# Altium project OpenCameraSlider.PrjPcb
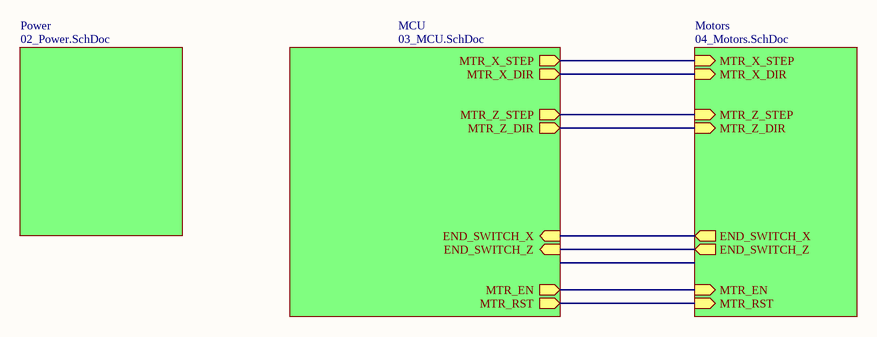
[diagram p0: 01_Top.SchDoc]
4 sheets, 18 parts. Net scope: hierarchical (ports join the sheet entries above them; power ports are global).
Board file: OpenCameraSlider_PCB.PcbDoc
Sheets:
  01_Top.SchDoc
    Power = 02_Power.SchDoc
    MCU = 03_MCU.SchDoc
    Motors = 04_Motors.SchDoc

## Sheet 01_Top.SchDoc: OpenCamera Slider - Top level schematic
size A4; SheetNumber: 1; SheetTotal: 4; Distributor: DigiKey

### Sub-sheets
MCU = 03_MCU.SchDoc: MTR_X_STEP (out), MTR_X_DIR (out), MTR_Z_STEP (out), MTR_Z_DIR (out), END_SWITCH_X (in), END_SWITCH_Z (in), MTR_EN (out), MTR_RST (out)
Motors = 04_Motors.SchDoc: MTR_X_STEP (in), MTR_Z_STEP (in), MTR_X_DIR (in), MTR_Z_DIR (in), END_SWITCH_Z (out), END_SWITCH_X (out), MTR_RST (in), MTR_EN (in)
Power = 02_Power.SchDoc: no entries

### Nets
END_SWITCH_X: sheet MCU/END_SWITCH_X, sheet Motors/END_SWITCH_X
END_SWITCH_Z: sheet MCU/END_SWITCH_Z, sheet Motors/END_SWITCH_Z
MTR_EN: sheet MCU/MTR_EN, sheet Motors/MTR_EN
MTR_RST: sheet MCU/MTR_RST, sheet Motors/MTR_RST
MTR_X_DIR: sheet MCU/MTR_X_DIR, sheet Motors/MTR_X_DIR
MTR_X_STEP: sheet MCU/MTR_X_STEP, sheet Motors/MTR_X_STEP
MTR_Z_DIR: sheet MCU/MTR_Z_DIR, sheet Motors/MTR_Z_DIR
MTR_Z_STEP: sheet MCU/MTR_Z_STEP, sheet Motors/MTR_Z_STEP

### Notes on the sheet
- sasakaranovic.com/youtube
- sasakaranovic.com
- sasakaranovic.com/github
- sasakaranovic.com/facebook
- sasakaranovic.com/twitter
- sasakaranovic.com/linkedin

## Sheet 02_Power.SchDoc: OpenCamera Slider - Power
size A4; SheetNumber: 2; SheetTotal: 4; Distributor: DigiKey
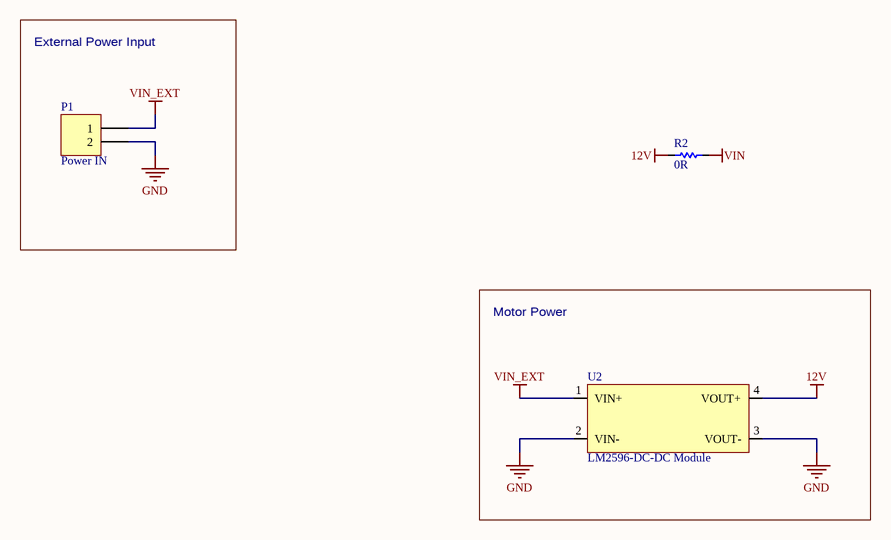
[diagram p1: 02_Power.SchDoc]

### Parts
P1  Power IN  [TERMINAL_2POS_90DEG_2PART]
R2  value 0R  [0603]  (hidden comment: Res)
U2  LM2596-DC-DC Module  [LM2596-DC-DC Module]

### Blocks framed on the sheet
External Power Input: P1
Motor Power: U2

### Nets
12V: R2.2 U2.4(VOUT+)
GND: P1.2 U2.2(VIN-) U2.3(VOUT-)
VIN: R2.1
VIN_EXT: P1.1 U2.1(VIN+)

### Notes on the sheet
- sasakaranovic.com/youtube
- sasakaranovic.com
- sasakaranovic.com/github
- sasakaranovic.com/facebook
- sasakaranovic.com/twitter
- sasakaranovic.com/linkedin

### Library data of the parts
P1 = Terminal 2_691322110002: 2 Position Terminal Block Header, Male Pins, Shrouded (4 Side) 0.138" (3.50mm) 90°, Right Angle - Through Hole; Manufacturer: Würth Elektronik; Manufacturer Part Number: 691322110002; Distributor: DigiKey; Distributor Part Number: 732-2769-ND
R2 = Res: Resistor; Manufacturer: YAGEO; Manufacturer Part Number: RC0603FR-130RL; Distributor: DigiKey; Distributor Part Number: 13-RC0603FR-130RLCT-ND
U2 = LM2596-DC-DC Module: LM2596-DC-DC Module HW-411; Distributor: AliExpress; Distributor Part Number: https://www.aliexpress.com/item/33004374185.html; Manufacturer Part Number: LM2596-DC-DC; URL: https://www.aliexpress.com/item/33004374185.html

## Sheet 03_MCU.SchDoc: OpenCamera Slider - MCU
size A4; SheetNumber: 3; SheetTotal: 4; Distributor: DigiKey
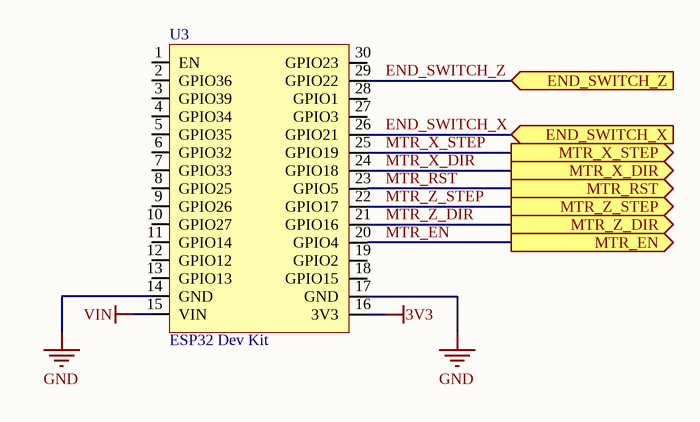
[diagram p2: 03_MCU.SchDoc]

### Parts
U3  ESP32 Dev Kit  [ESP32-DevModule]

### Ports
END_SWITCH_X (in), END_SWITCH_Z (in), MTR_EN (out), MTR_RST (out), MTR_X_DIR (out), MTR_X_STEP (out), MTR_Z_DIR (out), MTR_Z_STEP (out)

### Nets
3V3: U3.16(3V3)
GND: U3.14(GND) U3.17(GND)
VIN: U3.15(VIN)
END_SWITCH_X: U3.26(GPIO21) ; port END_SWITCH_X
END_SWITCH_Z: U3.29(GPIO22) ; port END_SWITCH_Z
MTR_EN: U3.20(GPIO4) ; port MTR_EN
MTR_RST: U3.23(GPIO5) ; port MTR_RST
MTR_X_DIR: U3.24(GPIO18) ; port MTR_X_DIR
MTR_X_STEP: U3.25(GPIO19) ; port MTR_X_STEP
MTR_Z_DIR: U3.21(GPIO16) ; port MTR_Z_DIR
MTR_Z_STEP: U3.22(GPIO17) ; port MTR_Z_STEP

Not connected (* = marked no-connect by the designer): U3 1(EN) 2(GPIO36) 3(GPIO39) 4(GPIO34) 5(GPIO35) 6(GPIO32) 7(GPIO33) 8(GPIO25) 9(GPIO26) 10(GPIO27) 11(GPIO14) 12(GPIO12) 13(GPIO13) 18(GPIO15) 19(GPIO2) 27(GPIO3) 28(GPIO1) 30(GPIO23)

### Notes on the sheet
- sasakaranovic.com/youtube
- sasakaranovic.com
- sasakaranovic.com/github
- sasakaranovic.com/facebook
- sasakaranovic.com/twitter
- sasakaranovic.com/linkedin

### Library data of the parts
U3 = ESP32_DEV: Manufacturer: Espressif; Distributor: AliExpress; Distributor Part Number: https://www.aliexpress.com/item/1005001757645011.html; URL: https://www.aliexpress.com/item/1005001757645011.html

## Sheet 04_Motors.SchDoc: OpenCamera Slider - Motors
size A4; SheetNumber: 4; SheetTotal: 4; Distributor: DigiKey
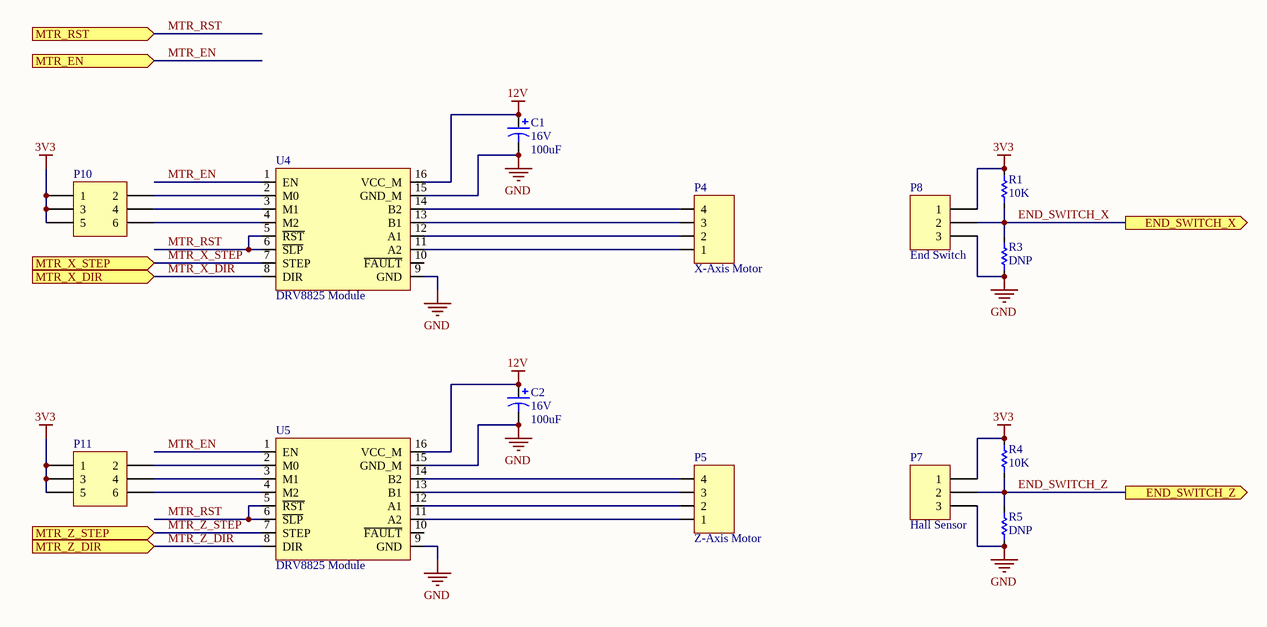
[diagram p3: 04_Motors.SchDoc]

### Parts
C1  16V  value 100uF  [Electrolytic Cap 3.2mm]
C2  16V  value 100uF  [Electrolytic Cap 3.2mm]
P4  X-Axis Motor  [TERMINAL_4POS_90DEG_2PART]
P5  Z-Axis Motor  [TERMINAL_4POS_90DEG_2PART]
P7  Hall Sensor  [TERMINAL_3POS_90DEG_2PART]
P8  End Switch  [TERMINAL_3POS_90DEG_2PART]
P10  Header 3X2  [HDR2X3]  (value not drawn)
P11  Header 3X2  [HDR2X3]  (value not drawn)
R1  value 10K  [0603]  (hidden comment: Res)
R3  value DNP  [0603]  (hidden comment: Res)  (no BOM)
R4  value 10K  [0603]  (hidden comment: Res)
R5  value DNP  [0603]  (hidden comment: Res)  (no BOM)
U4  DRV8825 Module  [DRV8825_Module]
U5  DRV8825 Module  [DRV8825_Module]

### Ports
END_SWITCH_X (out), END_SWITCH_Z (out), MTR_EN (in), MTR_RST (in), MTR_X_DIR (in), MTR_X_STEP (in), MTR_Z_DIR (in), MTR_Z_STEP (in)

### Nets
3V3: P7.1 P8.1 P10.1 P10.3 P10.5 P11.1 P11.3 P11.5 R1.2 R4.2
12V: C1.1 C2.1 U4.16(VCC_M) U5.16(VCC_M)
GND: C1.2 C2.2 P7.3 P8.3 R3.1 R5.1 U4.9(GND) U4.15(GND_M) U5.9(GND) U5.15(GND_M)
END_SWITCH_X: P8.2 R1.1 R3.2 ; port END_SWITCH_X
END_SWITCH_Z: P7.2 R4.1 R5.2 ; port END_SWITCH_Z
MTR_EN: U4.1(EN) U5.1(EN) ; port MTR_EN
MTR_RST: U4.5(~{RST}) U4.6(~{SLP}) U5.5(~{RST}) U5.6(~{SLP}) ; port MTR_RST
MTR_X_DIR: U4.8(DIR) ; port MTR_X_DIR
MTR_X_STEP: U4.7(STEP) ; port MTR_X_STEP
MTR_Z_DIR: U5.8(DIR) ; port MTR_Z_DIR
MTR_Z_STEP: U5.7(STEP) ; port MTR_Z_STEP
NetP4_1: P4.1 U4.11(A2)
NetP4_2: P4.2 U4.12(A1)
NetP4_3: P4.3 U4.13(B1)
NetP4_4: P4.4 U4.14(B2)
NetP5_1: P5.1 U5.11(A2)
NetP5_2: P5.2 U5.12(A1)
NetP5_3: P5.3 U5.13(B1)
NetP5_4: P5.4 U5.14(B2)
NetP10_2: P10.2 U4.2(M0)
NetP10_4: P10.4 U4.3(M1)
NetP10_6: P10.6 U4.4(M2)
NetP11_2: P11.2 U5.2(M0)
NetP11_4: P11.4 U5.3(M1)
NetP11_6: P11.6 U5.4(M2)

Not connected (* = marked no-connect by the designer): U4 10(~{FAULT}); U5 10(~{FAULT})

### Notes on the sheet
- sasakaranovic.com/youtube
- sasakaranovic.com
- sasakaranovic.com/github
- sasakaranovic.com/facebook
- sasakaranovic.com/twitter
- sasakaranovic.com/linkedin

### Library data of the parts
C1 C2 = Cap Electrolytic: Polarized Capacitor (Axial); Manufacturer: Würth Elektronik; Manufacturer Part Number: 870135675003; Distributor: DigiKey; Distributor Part Number: 732-11917-1-ND
P4 P5 = Terminal 4_691322110004: TERM BLOCK HDR 4POS 90DEG 3.5MM; Manufacturer: Würth Elektronik; Distributor: DigiKey; Distributor Part Number: 732-2771-ND; Manufacturer Part Number: 691322110004
P7 P8 = Terminal 3_691322110003_1: TERM BLOCK HDR 3POS 90DEG 3.5MM; Manufacturer: Würth Elektronik; Manufacturer Part Number: 691322110003; Distributor: DigiKey; Distributor Part Number: 732-2770-ND
P10 P11 = Header 3X2: Header, 3-Pin, Dual row; Manufacturer: Molex; Manufacturer Part Number: 0010897080; Distributor: DigiKey; Distributor Part Number: WM13106-ND
R1 R3-R5 = Res: Resistor; Manufacturer: YAGEO; Manufacturer Part Number: AA0603FR-0710KL; Distributor: DigiKey; Distributor Part Number: 13-AA0603FR-0710KLCT-ND
U4 U5 = DRV8825 Module: Distributor: AliExpress; Distributor Part Number: https://www.aliexpress.com/item/32597532420.html; URL: https://www.aliexpress.com/item/32597532420.html

## Nets that join several sheets
3V3: 03_MCU (U3.16), 04_Motors (10 pins)
12V: 02_Power (R2.2 U2.4), 04_Motors (C1.1 C2.1 U4.16 U5.16)
GND: 02_Power (P1.2 U2.2 U2.3), 03_MCU (U3.14 U3.17), 04_Motors (10 pins)
VIN: 02_Power (R2.1), 03_MCU (U3.15)
END_SWITCH_X: 03_MCU (U3.26), 04_Motors (P8.2 R1.1 R3.2)
END_SWITCH_Z: 03_MCU (U3.29), 04_Motors (P7.2 R4.1 R5.2)
MTR_EN: 03_MCU (U3.20), 04_Motors (U4.1 U5.1)
MTR_RST: 03_MCU (U3.23), 04_Motors (U4.5 U4.6 U5.5 U5.6)
MTR_X_DIR: 03_MCU (U3.24), 04_Motors (U4.8)
MTR_X_STEP: 03_MCU (U3.25), 04_Motors (U4.7)
MTR_Z_DIR: 03_MCU (U3.21), 04_Motors (U5.8)
MTR_Z_STEP: 03_MCU (U3.22), 04_Motors (U5.7)